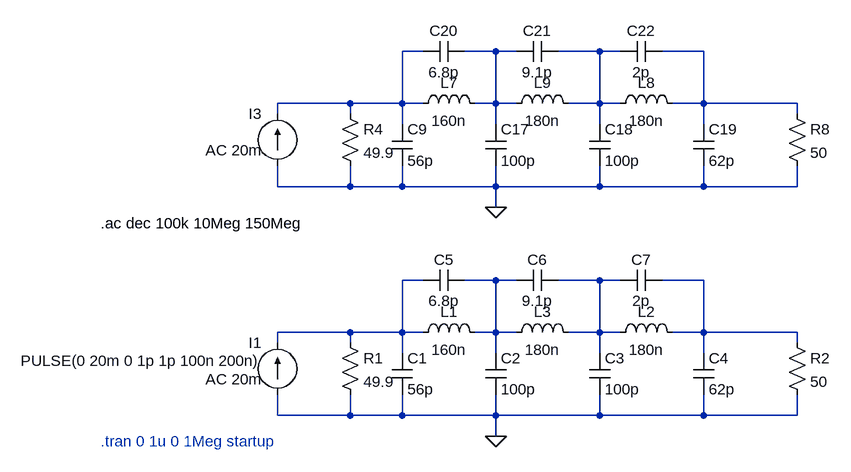
[diagram p0: schematic 滤波器.asc]
滤波器.asc, the LTspice schematic file:
Version 4.1
SHEET 1 1048 1876
WIRE 48 -1984 16 -1984
WIRE 160 -1984 112 -1984
WIRE 192 -1984 160 -1984
WIRE 320 -1984 256 -1984
WIRE 352 -1984 320 -1984
WIRE 480 -1984 416 -1984
WIRE -64 -1904 -176 -1904
WIRE 16 -1904 16 -1984
WIRE 16 -1904 -64 -1904
WIRE 48 -1904 16 -1904
WIRE 160 -1904 160 -1984
WIRE 160 -1904 128 -1904
WIRE 192 -1904 160 -1904
WIRE 320 -1904 320 -1984
WIRE 320 -1904 272 -1904
WIRE 352 -1904 320 -1904
WIRE 480 -1904 480 -1984
WIRE 480 -1904 432 -1904
WIRE 624 -1904 480 -1904
WIRE -176 -1888 -176 -1904
WIRE -64 -1888 -64 -1904
WIRE 624 -1888 624 -1904
WIRE 16 -1872 16 -1904
WIRE 160 -1872 160 -1904
WIRE 320 -1872 320 -1904
WIRE 480 -1872 480 -1904
WIRE -176 -1776 -176 -1808
WIRE -64 -1776 -64 -1808
WIRE -64 -1776 -176 -1776
WIRE 16 -1776 16 -1808
WIRE 16 -1776 -64 -1776
WIRE 160 -1776 160 -1808
WIRE 160 -1776 16 -1776
WIRE 320 -1776 320 -1808
WIRE 320 -1776 160 -1776
WIRE 480 -1776 480 -1808
WIRE 480 -1776 320 -1776
WIRE 624 -1776 624 -1808
WIRE 624 -1776 480 -1776
WIRE 160 -1744 160 -1776
WIRE 48 -1632 16 -1632
WIRE 160 -1632 112 -1632
WIRE 192 -1632 160 -1632
WIRE 320 -1632 256 -1632
WIRE 352 -1632 320 -1632
WIRE 480 -1632 416 -1632
WIRE -64 -1552 -176 -1552
WIRE 16 -1552 16 -1632
WIRE 16 -1552 -64 -1552
WIRE 48 -1552 16 -1552
WIRE 160 -1552 160 -1632
WIRE 160 -1552 128 -1552
WIRE 192 -1552 160 -1552
WIRE 320 -1552 320 -1632
WIRE 320 -1552 272 -1552
WIRE 352 -1552 320 -1552
WIRE 480 -1552 480 -1632
WIRE 480 -1552 432 -1552
WIRE 624 -1552 480 -1552
WIRE -176 -1536 -176 -1552
WIRE -64 -1536 -64 -1552
WIRE 624 -1536 624 -1552
WIRE 16 -1520 16 -1552
WIRE 160 -1520 160 -1552
WIRE 320 -1520 320 -1552
WIRE 480 -1520 480 -1552
WIRE -176 -1424 -176 -1456
WIRE -64 -1424 -64 -1456
WIRE -64 -1424 -176 -1424
WIRE 16 -1424 16 -1456
WIRE 16 -1424 -64 -1424
WIRE 160 -1424 160 -1456
WIRE 160 -1424 16 -1424
WIRE 320 -1424 320 -1456
WIRE 320 -1424 160 -1424
WIRE 480 -1424 480 -1456
WIRE 480 -1424 320 -1424
WIRE 624 -1424 624 -1456
WIRE 624 -1424 480 -1424
WIRE 160 -1392 160 -1424
FLAG 160 -1744 0
FLAG 160 -1392 0
SYMBOL res -80 -1552 R0
SYMATTR InstName R1
SYMATTR Value 49.9
SYMBOL res 608 -1552 R0
SYMATTR InstName R2
SYMATTR Value 50
SYMBOL res 608 -1904 R0
SYMATTR InstName R8
SYMATTR Value 50
SYMBOL current -176 -1808 R180
WINDOW 0 24 80 Left 2
WINDOW 3 24 52 Left 2
WINDOW 123 24 24 Left 2
WINDOW 39 0 0 Left 0
SYMATTR InstName I3
SYMATTR Value ""
SYMATTR Value2 AC 20m
SYMBOL cap 0 -1872 R0
SYMATTR InstName C9
SYMATTR Value 56p
SYMBOL cap 144 -1872 R0
SYMATTR InstName C17
SYMATTR Value 100p
SYMBOL cap 304 -1872 R0
SYMATTR InstName C18
SYMATTR Value 100p
SYMBOL ind 32 -1888 R270
WINDOW 0 32 56 VTop 2
WINDOW 3 5 56 VBottom 2
SYMATTR InstName L7
SYMATTR Value 160n
SYMATTR SpiceLine Ipk=0.6 Rser=600m Cpar=0
SYMBOL res -80 -1904 R0
SYMATTR InstName R4
SYMATTR Value 49.9
SYMBOL cap 464 -1872 R0
SYMATTR InstName C19
SYMATTR Value 62p
SYMBOL ind 336 -1888 R270
WINDOW 0 32 56 VTop 2
WINDOW 3 5 56 VBottom 2
SYMATTR InstName L8
SYMATTR Value 180n
SYMATTR SpiceLine Ipk=0.4 Rser=640m Cpar=0
SYMBOL cap 112 -2000 R90
WINDOW 0 0 32 VBottom 2
WINDOW 3 32 32 VTop 2
SYMATTR InstName C20
SYMATTR Value 6.8p
SYMBOL cap 192 -1968 R270
WINDOW 0 32 32 VTop 2
WINDOW 3 0 32 VBottom 2
SYMATTR InstName C21
SYMATTR Value 9.1p
SYMBOL cap 416 -2000 R90
WINDOW 0 0 32 VBottom 2
WINDOW 3 32 32 VTop 2
SYMATTR InstName C22
SYMATTR Value 2p
SYMBOL ind 176 -1888 R270
WINDOW 0 32 56 VTop 2
WINDOW 3 5 56 VBottom 2
SYMATTR InstName L9
SYMATTR Value 180n
SYMATTR SpiceLine Ipk=0.6 Rser=0.6 Cpar=0
SYMBOL cap 0 -1520 R0
SYMATTR InstName C1
SYMATTR Value 56p
SYMBOL cap 144 -1520 R0
SYMATTR InstName C2
SYMATTR Value 100p
SYMBOL cap 304 -1520 R0
SYMATTR InstName C3
SYMATTR Value 100p
SYMBOL ind 32 -1536 R270
WINDOW 0 32 56 VTop 2
WINDOW 3 5 56 VBottom 2
SYMATTR InstName L1
SYMATTR Value 160n
SYMATTR SpiceLine Ipk=0.6 Rser=600m Cpar=0
SYMBOL cap 464 -1520 R0
SYMATTR InstName C4
SYMATTR Value 62p
SYMBOL ind 336 -1536 R270
WINDOW 0 32 56 VTop 2
WINDOW 3 5 56 VBottom 2
SYMATTR InstName L2
SYMATTR Value 180n
SYMATTR SpiceLine Ipk=0.4 Rser=640m Cpar=0
SYMBOL cap 112 -1648 R90
WINDOW 0 0 32 VBottom 2
WINDOW 3 32 32 VTop 2
SYMATTR InstName C5
SYMATTR Value 6.8p
SYMBOL cap 192 -1616 R270
WINDOW 0 32 32 VTop 2
WINDOW 3 0 32 VBottom 2
SYMATTR InstName C6
SYMATTR Value 9.1p
SYMBOL cap 416 -1648 R90
WINDOW 0 0 32 VBottom 2
WINDOW 3 32 32 VTop 2
SYMATTR InstName C7
SYMATTR Value 2p
SYMBOL ind 176 -1536 R270
WINDOW 0 32 56 VTop 2
WINDOW 3 5 56 VBottom 2
SYMATTR InstName L3
SYMATTR Value 180n
SYMATTR SpiceLine Ipk=0.6 Rser=0.6 Cpar=0
SYMBOL current -176 -1456 R180
WINDOW 0 24 80 Left 2
WINDOW 3 24 52 Left 2
WINDOW 123 24 24 Left 2
WINDOW 39 0 0 Left 0
SYMATTR InstName I1
SYMATTR Value PULSE(0 20m 0 1p 1p 100n 200n)
SYMATTR Value2 AC 20m
TEXT -448 -1720 Left 2 !.ac dec 100k 10Meg 150Meg
TEXT -448 -1384 Left 2 ;.tran 0 1u 0 1Meg startup

The netlist it stands for:
* 滤波器.asc
R1 N005 0 49.9
R2 N008 0 50
R8 N004 0 50
I3 0 N001 AC 20m
C9 N001 0 56p
C17 N002 0 100p
C18 N003 0 100p
L7 N001 N002 160n Ipk=0.6 Rser=600m Cpar=0
R4 N001 0 49.9
C19 N004 0 62p
L8 N003 N004 180n Ipk=0.4 Rser=640m Cpar=0
C20 N002 N001 6.8p
C21 N002 N003 9.1p
C22 N004 N003 2p
L9 N002 N003 180n Ipk=0.6 Rser=0.6 Cpar=0
C1 N005 0 56p
C2 N006 0 100p
C3 N007 0 100p
L1 N005 N006 160n Ipk=0.6 Rser=600m Cpar=0
C4 N008 0 62p
L2 N007 N008 180n Ipk=0.4 Rser=640m Cpar=0
C5 N006 N005 6.8p
C6 N006 N007 9.1p
C7 N008 N007 2p
L3 N006 N007 180n Ipk=0.6 Rser=0.6 Cpar=0
I1 0 N005 PULSE(0 20m 0 1p 1p 100n 200n) AC 20m
.ac dec 100k 10Meg 150Meg
* .tran 0 1u 0 1Meg startup
.backanno
.end